# Altium schematic sheet NVME.SchDoc: DARKYDEN_NVME
size Letter; ApprovedBy: APPROUVÉ PAR; Author: Harold Malbrouck; Organization: Cegep Limoilou; Address1: 1300, 8e Avenue; Address2: Québec, QC; Address3: Canada; Address4: G1J 5L5; Revision: Rev.A; SheetNumber: 5; SheetTotal: 22
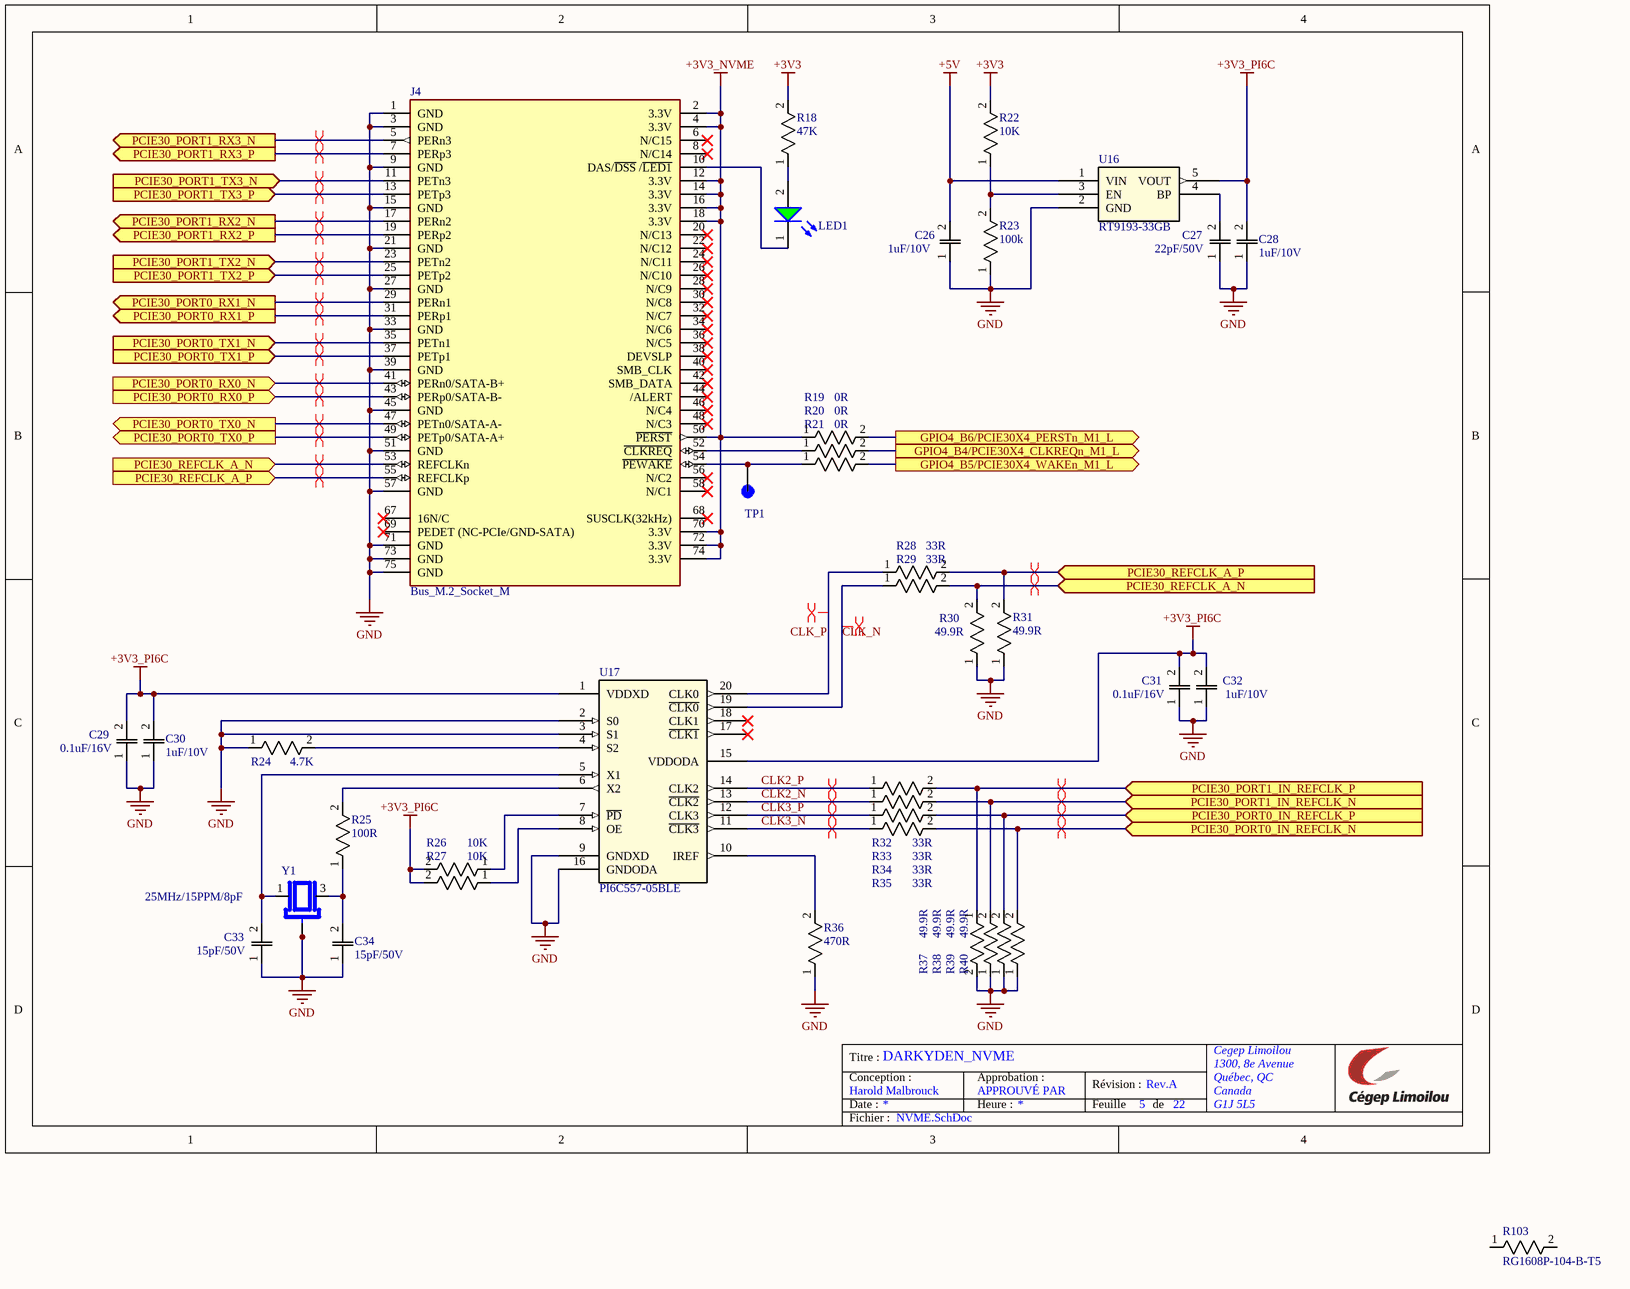
[diagram p0: NVME.SchDoc]

## Parts
C26  1uF/10V  [CAPC220145_100N_KEM]
C27  22pF/50V  [CAPC220145_145N_KEM]
C28  1uF/10V  [CAPC220145_100N_KEM]
C29  0.1uF/16V  [CAPC220145_88N_KEM]
C30  1uF/10V  [CAPC220145_100N_KEM]
C31  0.1uF/16V  [CAPC220145_88N_KEM]
C32  1uF/10V  [CAPC220145_100N_KEM]
C33  15pF/50V  [CAPC220145_88N_KEM]
C34  15pF/50V  [CAPC220145_88N_KEM]
J4  Bus_M.2_Socket_M  [AMPHENOL_MDT420M03001]
LED1  Green, 3.2V, 140°  [WL-SMCD_0603]  (value not drawn)
R18  47K  [RC0603N_PAN]
R19  0R  [ERJ3EKF1000V]
R20  0R  [ERJ3EKF1000V]
R21  0R  [ERJ3EKF1000V]
R22  10K  [ERJ3EKF1000V]
R23  100k  [ERJ3EKF1000V]
R24  4.7K  [RC0603N_PAN]
R25  100R  [RESC1608X55N]
R26  10K  [ERJ3EKF1000V]
R27  10K  [ERJ3EKF1000V]
R28  33R  [RC0603N_PAN]
R29  33R  [RC0603N_PAN]
R30  49.9R  [RC0603N_PAN]
R31  49.9R  [RC0603N_PAN]
R32  33R  [RC0603N_PAN]
R33  33R  [RC0603N_PAN]
R34  33R  [RC0603N_PAN]
R35  33R  [RC0603N_PAN]
R36  470R  [RC0603N_PAN]
R37  49.9R  [RC0603N_PAN]
R38  49.9R  [RC0603N_PAN]
R39  49.9R  [RC0603N_PAN]
R40  49.9R  [RC0603N_PAN]
R103  RG1608P-104-B-T5  [RES_0816_SUS]
TP1  5006  [KEYSTONE_5006]  (value not drawn)
U16  RT9193-33GB  [SOT-23-5_RIT]
U17  PI6C557-05BLE  [L20_PER-M]
Y1  25MHz/15PPM/8pF  [XTAL_ECS-250-8-37B2-RWY-TR]

## Ports
GPIO4_B4/PCIE30X4_CLKREQn_M1_L (out, see CONNECTEUR_3[1C]), GPIO4_B5/PCIE30X4_WAKEn_M1_L (out, see CONNECTEUR_3[2C]), GPIO4_B6/PCIE30X4_PERSTn_M1_L (out, see CONNECTEUR_3[2C]), PCIE30_PORT0_IN_REFCLK_N (in, see CONNECTEUR_3[3A]), PCIE30_PORT0_IN_REFCLK_P (in, see CONNECTEUR_3[3A]), PCIE30_PORT0_RX0_N (in, see CONNECTEUR_3[3A]), PCIE30_PORT0_RX0_P (in, see CONNECTEUR_3[3A]), PCIE30_PORT0_RX1_N (out, see CONNECTEUR_3[3A]), PCIE30_PORT0_RX1_P (out, see CONNECTEUR_3[3A]), PCIE30_PORT0_TX0_N (out, see CONNECTEUR_3[3B]), PCIE30_PORT0_TX0_P (out, see CONNECTEUR_3[3A]), PCIE30_PORT0_TX1_N (in, see CONNECTEUR_3[3B]), PCIE30_PORT0_TX1_P (in, see CONNECTEUR_3[3B]), PCIE30_PORT1_IN_REFCLK_N (in, see CONNECTEUR_3[3B]), PCIE30_PORT1_IN_REFCLK_P (in, see CONNECTEUR_3[3B]), PCIE30_PORT1_RX2_N (out, see CONNECTEUR_3[3B]), PCIE30_PORT1_RX2_P (out, see CONNECTEUR_3[3B]), PCIE30_PORT1_RX3_N (out, see CONNECTEUR_3[3B]), PCIE30_PORT1_RX3_P (out, see CONNECTEUR_3[3B]), PCIE30_PORT1_TX2_N (in, see CONNECTEUR_3[3B]), PCIE30_PORT1_TX2_P (in, see CONNECTEUR_3[3B]), PCIE30_PORT1_TX3_N (in, see CONNECTEUR_3[3B]), PCIE30_PORT1_TX3_P (in, see CONNECTEUR_3[3B]), PCIE30_REFCLK_A_N (in, see NVME[1B]), PCIE30_REFCLK_A_N (in, see NVME[3C]), PCIE30_REFCLK_A_P (in, see NVME[1B]), PCIE30_REFCLK_A_P (in, see NVME[3B])

## Nets
+3V3: R18.2 R22.2
+3V3_NVME: J4.2(3.3V) J4.4(3.3V) J4.12(3.3V) J4.14(3.3V) J4.16(3.3V) J4.18(3.3V) J4.50(~{PERST}) J4.70(3.3V) J4.72(3.3V) J4.74(3.3V) R19.1
+3V3_PI6C: C28.2 C29.2 C30.2 C31.2 C32.2 R26.2 R27.2 U16.5(VOUT) U17.1(VDDXD) U17.15(VDDODA)
+5V: C26.2 U16.1(VIN)
GND: C26.1 C27.1 C28.1 C29.1 C30.1 C31.1 C32.1 C33.1 C34.1 J4.1(GND) J4.3(GND) J4.9(GND) J4.15(GND) J4.21(GND) J4.27(GND) J4.33(GND) J4.39(GND) J4.45(GND) J4.51(GND) J4.57(GND) J4.71(GND) J4.73(GND) J4.75(GND) R23.1 R24.1 R30.1 R31.1 R36.1 R37.2 R38.1 R39.1 R40.1 U16.2(GND) U17.2(S0) U17.3(S1) U17.9(GNDXD) U17.16(GNDODA) Y1.2(GND) Y1.4(GND)
CLK2_N: R33.1 U17.13(~{CLK2})
CLK2_P: R32.1 U17.14(CLK2)
CLK3_N: R35.1 U17.11(~{CLK3})
CLK3_P: R34.1 U17.12(CLK3)
CLK_N: R29.1 U17.19(~{CLK0})
CLK_P: R28.1 U17.20(CLK0)
GPIO4_B4/PCIE30X4_CLKREQn_M1_L: R20.2 ; port GPIO4_B4/PCIE30X4_CLKREQn_M1_L
GPIO4_B5/PCIE30X4_WAKEn_M1_L: R21.2 ; port GPIO4_B5/PCIE30X4_WAKEn_M1_L
GPIO4_B6/PCIE30X4_PERSTn_M1_L: R19.2 ; port GPIO4_B6/PCIE30X4_PERSTn_M1_L
PCIE30_PORT0_IN_REFCLK_N: R35.2 R40.2 ; port PCIE30_PORT0_IN_REFCLK_N
PCIE30_PORT0_IN_REFCLK_P: R34.2 R39.2 ; port PCIE30_PORT0_IN_REFCLK_P
PCIE30_PORT0_RX0_N: J4.41(PERn0/SATA-B+) ; port PCIE30_PORT0_RX0_N
PCIE30_PORT0_RX0_P: J4.43(PERp0/SATA-B-) ; port PCIE30_PORT0_RX0_P
PCIE30_PORT0_RX1_N: J4.29(PERn1) ; port PCIE30_PORT0_RX1_N
PCIE30_PORT0_RX1_P: J4.31(PERp1) ; port PCIE30_PORT0_RX1_P
PCIE30_PORT0_TX0_N: J4.47(PETn0/SATA-A-) ; port PCIE30_PORT0_TX0_N
PCIE30_PORT0_TX0_P: J4.49(PETp0/SATA-A+) ; port PCIE30_PORT0_TX0_P
PCIE30_PORT0_TX1_N: J4.35(PETn1) ; port PCIE30_PORT0_TX1_N
PCIE30_PORT0_TX1_P: J4.37(PETp1) ; port PCIE30_PORT0_TX1_P
PCIE30_PORT1_IN_REFCLK_N: R33.2 R38.2 ; port PCIE30_PORT1_IN_REFCLK_N
PCIE30_PORT1_IN_REFCLK_P: R32.2 R37.1 ; port PCIE30_PORT1_IN_REFCLK_P
PCIE30_PORT1_RX2_N: J4.17(PERn2) ; port PCIE30_PORT1_RX2_N
PCIE30_PORT1_RX2_P: J4.19(PERp2) ; port PCIE30_PORT1_RX2_P
PCIE30_PORT1_RX3_N: J4.5(PERn3) ; port PCIE30_PORT1_RX3_N
PCIE30_PORT1_RX3_P: J4.7(PERp3) ; port PCIE30_PORT1_RX3_P
PCIE30_PORT1_TX2_N: J4.23(PETn2) ; port PCIE30_PORT1_TX2_N
PCIE30_PORT1_TX2_P: J4.25(PETp2) ; port PCIE30_PORT1_TX2_P
PCIE30_PORT1_TX3_N: J4.11(PETn3) ; port PCIE30_PORT1_TX3_N
PCIE30_PORT1_TX3_P: J4.13(PETp3) ; port PCIE30_PORT1_TX3_P
PCIE30_REFCLK_A_N: J4.53(REFCLKn) R29.2 R30.2 ; port PCIE30_REFCLK_A_N
PCIE30_REFCLK_A_P: J4.55(REFCLKp) R28.2 R31.2 ; port PCIE30_REFCLK_A_P
NetC27_2: C27.2 U16.4(BP)
NetC33_2: C33.2 U17.5(X1) Y1.1(IN/OUT)
NetC34_2: C34.2 R25.1 Y1.3(OUT/IN)
NetJ4_10: J4.10(DAS/~{DSS}_/~{LED1}) LED1.1(K)
NetJ4_52: J4.52(~{CLKREQ}) R20.1
NetJ4_54: J4.54(~{PEWAKE}) R21.1 TP1.TP
NetLED1_2: LED1.2(A) R18.1
NetR22_1: R22.1 R23.2 U16.3(EN)
NetR24_2: R24.2 U17.4(S2)
NetR25_2: R25.2 U17.6(X2)
NetR26_1: R26.1 U17.7(~{PD})
NetR27_1: R27.1 U17.8(OE)
NetR36_2: R36.2 U17.10(IREF)

Not connected (* = marked no-connect by the designer): J4 6(N/C15)* 8(N/C14)* 20(N/C13)* 22(N/C12)* 24(N/C11)* 26(N/C10)* 28(N/C9)* 30(N/C8)* 32(N/C7)* 34(N/C6)* 36(N/C5)* 38(DEVSLP)* 40(SMB_CLK)* 42(SMB_DATA)* 44(/ALERT)* 46(N/C4)* 48(N/C3)* 56(N/C2)* 58(N/C1)* 67(16N/C)* 68(SUSCLK(32kHz))* 69(PEDET_(NC-PCIe/GND-SATA))*; R103 1 2; U17 17(~{CLK1})* 18(CLK1)*

## Layout directives
differential pair: CLK2_N, CLK2_P, CLK3_N, CLK3_P, CLK_N, CLK_P, PCIE30_PORT0_IN_REFCLK_N, PCIE30_PORT0_IN_REFCLK_P, PCIE30_PORT0_RX0_N, PCIE30_PORT0_RX0_P, PCIE30_PORT0_RX1_N, PCIE30_PORT0_RX1_P, PCIE30_PORT0_TX0_N, PCIE30_PORT0_TX0_P, PCIE30_PORT0_TX1_N, PCIE30_PORT0_TX1_P, PCIE30_PORT1_IN_REFCLK_N, PCIE30_PORT1_IN_REFCLK_P, PCIE30_PORT1_RX2_N, PCIE30_PORT1_RX2_P, PCIE30_PORT1_RX3_N, PCIE30_PORT1_RX3_P, PCIE30_PORT1_TX2_N, PCIE30_PORT1_TX2_P, PCIE30_PORT1_TX3_N, PCIE30_PORT1_TX3_P, PCIE30_REFCLK_A_N, PCIE30_REFCLK_A_P

## Notes on the sheet
- Titre :
- Conception :
- Date :
- Approbation :
- Heure :
- Révision :
- Feuille
- de
- Fichier :

## Library data of the parts
C26 C28 C30 C32 = C0805C105K8RACTU: Multilayer Ceramic Capacitors MLCC - SMD/SMT 10V 1uF X7R 0805 10%; Mfr_Name: Kemet; Material: 4241ConductorMaterial; Dissipation Factor: 5%; Supplier: Digikey; Supplier Part Number: 399-C0805C105K8RACTUCT-ND; Manufacturer: KEMET; Manufacturer Part Number: C0805C105K8RACTU; RoHS: Yes; Category: Ceramic Capacitors; Stock: 113387; Pricing: 1=0.2, 10=0.112, 100=0.0701, 1000=0.04837 (USD); Mounting Technology: Surface Mount; Case/Package: 0805; Pins: 2NUMBER; Case Code (Imperial): 0805; Case Code (Metric): 2012; Dielectric Material: Ceramic; Min Operating Temperature: -55°C; Max Operating Temperature: 125°C; Packaging: Tape and Reel; Tolerance: 10%; Value: 1uF; Dielectric: X7R; Package Quantity: 1; Voltage Rating: 10V; Voltage Rating (DC): 10V; Termination: SMD/SMT; Voltage: 10V; Series: C; Construction: Flat; Length: 2mm; Width: 0.049inch; Height: 0.9mm; Depth: 1.25mm; Thickness: 0.039inch; Lead Pitch: 0.75mm; Radiation Hardening: No; Reach SVHC Compliant: No; RoHS Compliant: Yes; Lead Free: 5697LeadFree; ComponentLink1URL: https://datasheet.ciiva.com/6074/kem-c1002-x7r-smd-6074662.pdf?src-supplier=Farnell; ComponentLink1Description: https://datasheet.ciiva.com/6074/kem-c1002-x7r-smd-6074662.pdf?src-supplier=Farnell; ComponentLink2URL: https://datasheet.ciiva.com/22749/1918693-22749723.pdf?src-supplier=Element14; ComponentLink2Description: https://datasheet.ciiva.com/22749/1918693-22749723.pdf?src-supplier=Element14; ComponentLink3URL: https://datasheet.ciiva.com/46385/1851736-46385656.pdf?src-supplier=Element14; ComponentLink3Description: https://datasheet.ciiva.com/46385/1851736-46385656.pdf?src-supplier=Element14; ComponentLink4URL: https://datasheet.ciiva.com/46443/1851736-46443534.pdf?src-supplier=Element14; ComponentLink4Description: https://datasheet.ciiva.com/46443/1851736-46443534.pdf?src-supplier=Element14
C27 = C0805C220J5RACTU: Cap Ceramic 22pF 50V X7R 5% Pad SMD 0805 125°C T/R; Mfr_Name: Kemet; Temperature Coefficient: 30ppm/°C; Supplier: Digikey; Supplier Part Number: 399-17625-1-ND; Manufacturer: KEMET; Manufacturer Part Number: C0805C220J5RACTU; RoHS: Yes; Category: Ceramic Capacitors; Stock: 8069; Pricing: 1=0.13, 10=0.072, 100=0.0434, 1000=0.02906 (USD); Case/Package: 0805; Material: Ceramic; Dielectric Material: Ceramic; Min Operating Temperature: -55°C; Max Operating Temperature: 125°C; Value: 22pF; Dielectric: X7R; Voltage Rating: 50V; Voltage Rating (DC): 50V; Height: 880um; RoHS Compliant: Yes; ComponentLink1URL: https://datasheet.octopart.com/C0805C220J5RACTU-KEMET-datasheet-130256537.pdf?src-supplier=Farnell; ComponentLink1Description: https://datasheet.octopart.com/C0805C220J5RACTU-KEMET-datasheet-130256537.pdf?src-supplier=Farnell; ComponentLink2URL: https://datasheet.octopart.com/C0805C220J5RACTU-KEMET-datasheet-170333836.pdf?src-supplier=Newark; ComponentLink2Description: https://datasheet.octopart.com/C0805C220J5RACTU-KEMET-datasheet-170333836.pdf?src-supplier=Newark
C29 C31 = C0805C104K4RACAUTO: 0805 (2012METRIC) Ceramic Capacitor SMD Auto X7R 16V 0.1MUF ±10% X7R; Mfr_Name: Kemet; Material: 4241ConductorMaterial; Value: 100nF; Temperature Coefficient: 30ppm/°C; Supplier: Digikey; Supplier Part Number: 399-C0805C104K4RACAUTOCT-ND; Manufacturer: KEMET; Manufacturer Part Number: C0805C104K4RACAUTO; RoHS: Yes; Category: Ceramic Capacitors; Stock: 27573; Pricing: 1=0.19, 10=0.108, 100=0.0672, 1000=0.04624 (USD); Case/Package: 0805; Dielectric Material: 4241ConductorMaterial; Min Operating Temperature: -55°C; Max Operating Temperature: 125°C; Tolerance: 10%; Packaging: Tape and Reel; Dielectric: X7R; Voltage Rating: 16V; Voltage Rating (DC): 16V; Length: 2mm; Depth: 1.25mm; RoHS Compliant: Yes
C33 C34 = C0805C150K5RACAUTO: Multilayer Ceramic Capacitors MLCC - SMD/SMT 50V 15pF X7R 0805 10% AEC-Q200; Mfr_Name: Kemet; Supplier: Digikey; Supplier Part Number: 399-C0805C150K5RACAUTOCT-ND; Manufacturer: KEMET; Manufacturer Part Number: C0805C150K5RACAUTO; RoHS: Yes; Category: Ceramic Capacitors; Stock: 14268; Pricing: 1=0.22, 10=0.124, 100=0.0903 (USD); RoHS Compliant: Yes; ComponentLink1URL: https://datasheet.octopart.com/C0805C150K5RACAUTO-KEMET-datasheet-149524000.pdf?src-supplier=Farnell; ComponentLink1Description: https://datasheet.octopart.com/C0805C150K5RACAUTO-KEMET-datasheet-149524000.pdf?src-supplier=Farnell; ComponentLink2URL: https://datasheet.octopart.com/C0805C150K5RACAUTO-KEMET-datasheet-170212647.pdf?src-supplier=Newark; ComponentLink2Description: https://datasheet.octopart.com/C0805C150K5RACAUTO-KEMET-datasheet-170212647.pdf?src-supplier=Newark
J4 = Bus_M.2_Socket_M: MF: Amphenol Commercial; MP: MDT420M03001; Package: None; Price: None; Value: *; Availability: Unavailable
LED1 = GREEN: WL-SMCD Mono-color Chip LED Diffused, SMT, size 0603, Green, 3.2V, 140°; Manufacturer Part Number: 150060GS55040; Manufacturer: Wurth Elektronik; Case/Size Code: 0603; Chip Technology: InGaN; Dominant Wavelength: 525nm; Luminous Intensity: 430mcd; Peak Wavelength: 520nm; Category: Signal LEDs; Match Code: WL-SMCD; ComponentLink1Description: Website Link; ComponentLink1URL: https://www.we-online.com/redexpert/article/150060GS55040?ad; ComponentLink2Description: Datasheet Link; ComponentLink2URL: https://www.we-online.com/redexpert/spec/150060GS55040?ad; Mount: Surface Mount; Operating Temperature Max: 85°C; Operating Temperature Min: -40°C; Packaging: Tape and Reel; Length: 1.6mm; Width: 0.8mm; Height: 0.4mm; Emitting Color: Green; Forward Voltage: 3.2V; Viewing Angle: 140°
R18 = ERJ-3GEYJ473V: Resistor Thick Film 0603 47K Ohm 5% 1/10W 200ppm/C Molded SMD Punched Carrier T/R; Mfr_Name: Panasonic; Voltage Rating: 75V; Voltage Rating (DC): 50V; Value: 47kR; Power Rating: 100mW; Temperature Coefficient: 200ppm/°C; Supplier: Digikey; Supplier Part Number: P47KGCT-ND; Manufacturer: Panasonic; Manufacturer Part Number: ERJ-3GEYJ473V; RoHS: Yes; Category: Chip SMD Resistors; Stock: 564429; Pricing: 1=0.1, 10=0.033, 50=0.02, 100=0.0165, 500=0.01096, 1000=0.00939 (USD); Mounting Technology: Surface Mount; Case/Package: 0603; Contact Plating: Tin; Case Code (Metric): 1608; Case Code (Imperial): 0603; Min Operating Temperature: -55°C; Max Operating Temperature: 155°C; Package Quantity: 1; Termination: SMD/SMT; Series: ERJ; Tolerance: 5%; Packaging: Tape and Reel; Resistor Type: Thick Film; Number of Terminations: 2; Max Power Dissipation: 100mW; Features: Automotive AEC-Q200; Construction: Rectangular; Resistance Tolerance: 5%; Technology: THICK FILM; Length: 1.6mm; Width: 0.8mm; Height: 0.45mm; Depth: 0.8mm; Radiation Hardening: No; Reach SVHC Compliant: No; Lead Free: Lead Free; Military Standard: Not; RoHS Compliant: Yes; ComponentLink1URL: https://datasheet.ciiva.com/11821/0900766b80f806dd-11821464.pdf?src-supplier=Rs; ComponentLink1Description: https://datasheet.ciiva.com/11821/0900766b80f806dd-11821464.pdf?src-supplier=Rs; ComponentLink2URL: https://datasheet.ciiva.com/48531/aoa0000ce1-48531644.pdf?src-supplier=Avnet; ComponentLink2Description: https://datasheet.ciiva.com/48531/aoa0000ce1-48531644.pdf?src-supplier=Avnet; ComponentLink3URL: https://datasheet.ciiva.com/24024/aoa0000ce1-37422-24024310.pdf?src-supplier=Mouser; ComponentLink3Description: https://datasheet.ciiva.com/24024/aoa0000ce1-37422-24024310.pdf?src-supplier=Mouser; ComponentLink4URL: https://datasheet.ciiva.com/28587/1678796-28587208.pdf?src-supplier=Element14; ComponentLink4Description: https://datasheet.ciiva.com/28587/1678796-28587208.pdf?src-supplier=Element14; ComponentLink5URL: https://datasheet.ciiva.com/28681/1678796-28681548.pdf?src-supplier=Element14; ComponentLink5Description: https://datasheet.ciiva.com/28681/1678796-28681548.pdf?src-supplier=Element14; ComponentLink6URL: https://datasheet.ciiva.com/46377/1500035-46377557.pdf?src-supplier=Element14; ComponentLink6Description: https://datasheet.ciiva.com/46377/1500035-46377557.pdf?src-supplier=Element14; ComponentLink7URL: https://datasheet.ciiva.com/46389/1500035-46389464.pdf?src-supplier=Element14; ComponentLink7Description: https://datasheet.ciiva.com/46389/1500035-46389464.pdf?src-supplier=Element14
R19-R21 = ERJ-3GEY0R00V: Zero Ohm Resistor, Jumper, 0603 [1608 Metric], Thick Film, 100 mW, 1 A, Surface Mount; Manufacturer_Name: Panasonic; Power Rating: 100mW; Voltage Rating: 75V; Tolerance: 0%; Temperature Coefficient: 200ppm/°C; Datasheet Link: http://docs-europe.electrocomponents.com/webdocs/13ba/0900766b813ba21b.pdf; Height: 0.55mm; Manufacturer_Part_Number: ERJ-3GEY0R00V; Mouser Part Number: 667-ERJ-3GEY0R00V; Mouser Price/Stock: https://www.mouser.co.uk/ProductDetail/Panasonic/ERJ-3GEY0R00V?qs=66DK8nO8gJALIOqOWgiVwg%3D%3D; Arrow Part Number: ERJ-3GEY0R00V; Arrow Price/Stock: https://www.arrow.com/en/products/erj3gey0r00v/panasonic?region=europe; Supplier: Digikey; Supplier Part Number: P0.0GCT-ND; Manufacturer: Panasonic; Manufacturer Part Number: ERJ-3GEY0R00V; RoHS: Yes; Category: Chip SMD Resistors; Stock: 766631; Pricing: 1=0.1, 10=0.02, 25=0.0164, 50=0.0144, 100=0.0126, 250=0.0106, 500=0.00936, 1000=0.0083 (USD); Mounting Technology: Surface Mount; Case/Package: 0603; Case Code (Metric): 1608; Case Code (Imperial): 0603; Contact Plating: Tin; Min Operating Temperature: -55°C; Max Operating Temperature: 155°C; Packaging: Tape and Reel; Package Quantity: 5000; Value: 0R; Resistor Type: Thick Film; Number of Terminations: 2; Termination: SMD/SMT; Max Power Dissipation: 100mW; Features: Automotive AEC-Q200; Series: ERJ; Construction: Rectangular; Technology: THICK FILM; Length: 1.6mm; Width: 0.8mm; Depth: 0.8mm; Ratings: AEC-Q200; Radiation Hardening: No; Reach SVHC Compliant: No; Military Standard: Not; RoHS Compliant: Yes; Lead Free: 5697LeadFree; ComponentLink1URL: https://datasheet.ciiva.com/11808/0900766b80f806dd-11808207.pdf?src-supplier=Rs; ComponentLink1Description: https://datasheet.ciiva.com/11808/0900766b80f806dd-11808207.pdf?src-supplier=Rs; ComponentLink2URL: https://datasheet.ciiva.com/27055/1935748-27055113.pdf?src-supplier=Jameco; ComponentLink2Description: https://datasheet.ciiva.com/27055/1935748-27055113.pdf?src-supplier=Jameco; ComponentLink3URL: https://datasheet.ciiva.com/5959/1678796-5959707.pdf?src-supplier=Farnell; ComponentLink3Description: https://datasheet.ciiva.com/5959/1678796-5959707.pdf?src-supplier=Farnell; ComponentLink4URL: https://datasheet.ciiva.com/43460/1678796-43460647.pdf?src-supplier=Farnell; ComponentLink4Description: https://datasheet.ciiva.com/43460/1678796-43460647.pdf?src-supplier=Farnell; ComponentLink5URL: https://datasheet.ciiva.com/48532/aoa0000ce1-48532165.pdf?src-supplier=Avnet; ComponentLink5Description: https://datasheet.ciiva.com/48532/aoa0000ce1-48532165.pdf?src-supplier=Avnet; ComponentLink6URL: https://datasheet.ciiva.com/28695/1678796-28695833.pdf?src-supplier=Element14; ComponentLink6Description: https://datasheet.ciiva.com/28695/1678796-28695833.pdf?src-supplier=Element14; ComponentLink7URL: https://datasheet.ciiva.com/16834/aoa0000ce1-16834828.pdf?src-supplier=Future+Electronics; ComponentLink7Description: https://datasheet.ciiva.com/16834/aoa0000ce1-16834828.pdf?src-supplier=Future+Electronics; ComponentLink8URL: https://datasheet.ciiva.com/16758/70255313-16758527.pdf?src-supplier=Allied+Electronics; ComponentLink8Description: https://datasheet.ciiva.com/16758/70255313-16758527.pdf?src-supplier=Allied+Electronics; ComponentLink9URL: https://datasheet.ciiva.com/30199/4aoa0000ce1-30199822.pdf?src-supplier=Onlinecomponents.com; ComponentLink9Description: https://datasheet.ciiva.com/30199/4aoa0000ce1-30199822.pdf?src-supplier=Onlinecomponents.com; ComponentLink10URL: https://datasheet.ciiva.com/46377/1678796-46377868.pdf?src-supplier=Element14; ComponentLink10Description: https://datasheet.ciiva.com/46377/1678796-46377868.pdf?src-supplier=Element14; ComponentLink11URL: https://datasheet.ciiva.com/9198/aoa0000ce1-9198975.pdf?src-supplier=Avnet; ComponentLink11Description: https://datasheet.ciiva.com/9198/aoa0000ce1-9198975.pdf?src-supplier=Avnet
R22 R26 R27 = ERJ-3GEYJ103V: 10K Ohm 5% Res Thick Film 0603  0.1W(1/10W) ±200ppm/C Pad SMD Automotive T/R; Manufacturer_Name: Panasonic; Value: 10kR; Temperature Coefficient: 200ppm/°C; Power Rating: 100mW; Voltage Rating: 75V; Datasheet Link: http://docs-europe.electrocomponents.com/webdocs/13ba/0900766b813ba21b.pdf; Height: 0.55mm; Manufacturer_Part_Number: ERJ-3GEYJ103V; Mouser Part Number: 667-ERJ-3GEYJ103V; Mouser Price/Stock: https://www.mouser.co.uk/ProductDetail/Panasonic/ERJ-3GEYJ103V?qs=66DK8nO8gJBWgc%252B0VNNxzg%3D%3D; Arrow Part Number: ERJ-3GEYJ103V; Arrow Price/Stock: https://www.arrow.com/en/products/erj-3geyj103v/panasonic?region=europe; Supplier: Digikey; Supplier Part Number: P10KGCT-ND; Manufacturer: Panasonic; Manufacturer Part Number: ERJ-3GEYJ103V; RoHS: Yes; Category: Chip SMD Resistors; Stock: 2191587; Pricing: 1=0.1, 10=0.033, 50=0.02, 100=0.0165, 500=0.01096, 1000=0.00939 (USD); Mounting Technology: Surface Mount; Case/Package: 0603; Case Code (Imperial): 0603; Case Code (Metric): 1608; Weight: 7.1E-05oz; Contact Plating: Tin; Min Operating Temperature: -55°C; Max Operating Temperature: 155°C; Tolerance: 5%; Packaging: Tape and Reel; Technology: THICK FILM; Package Quantity: 1; Resistor Type: Thick Film; Termination: SMD/SMT; Number of Terminations: 2; Max Power Dissipation: 100mW; Working Voltage: 75V; Features: Automotive AEC-Q200; Series: ERJ; Construction: Rectangular; Resistance Tolerance: 5%; Length: 1.6mm; Width: 0.8mm; Depth: 0.8mm; Reach SVHC Compliant: No; Military Standard: Not; Lead Free: Lead Free; RoHS Compliant: Yes; ComponentLink1URL: https://datasheet.ciiva.com/11809/0900766b80f806dd-11809566.pdf?src-supplier=Rs; ComponentLink1Description: https://datasheet.ciiva.com/11809/0900766b80f806dd-11809566.pdf?src-supplier=Rs; ComponentLink2URL: https://datasheet.ciiva.com/34303/2007265-34303757.pdf?src-supplier=Jameco; ComponentLink2Description: https://datasheet.ciiva.com/34303/2007265-34303757.pdf?src-supplier=Jameco; ComponentLink3URL: https://datasheet.ciiva.com/48531/aoa0000ce1-48531887.pdf?src-supplier=Avnet; ComponentLink3Description: https://datasheet.ciiva.com/48531/aoa0000ce1-48531887.pdf?src-supplier=Avnet; ComponentLink4URL: https://datasheet.ciiva.com/9117/aoa0000ce1-9117038.pdf?src-supplier=Avnet; ComponentLink4Description: https://datasheet.ciiva.com/9117/aoa0000ce1-9117038.pdf?src-supplier=Avnet; ComponentLink5URL: https://datasheet.ciiva.com/28514/1678796-28514213.pdf?src-supplier=Element14; ComponentLink5Description: https://datasheet.ciiva.com/28514/1678796-28514213.pdf?src-supplier=Element14; ComponentLink6URL: https://datasheet.ciiva.com/46371/1678796-46371909.pdf?src-supplier=Element14; ComponentLink6Description: https://datasheet.ciiva.com/46371/1678796-46371909.pdf?src-supplier=Element14; ComponentLink7URL: https://datasheet.ciiva.com/46385/1678796-46385240.pdf?src-supplier=Element14; ComponentLink7Description: https://datasheet.ciiva.com/46385/1678796-46385240.pdf?src-supplier=Element14; ComponentLink8URL: https://datasheet.ciiva.com/24133/aoa0000ce1-37422-24133064.pdf?src-supplier=Mouser; ComponentLink8Description: https://datasheet.ciiva.com/24133/aoa0000ce1-37422-24133064.pdf?src-supplier=Mouser; ComponentLink9URL: https://datasheet.ciiva.com/16740/aoa0000ce1-16740655.pdf?src-supplier=Future+Electronics; ComponentLink9Description: https://datasheet.ciiva.com/16740/aoa0000ce1-16740655.pdf?src-supplier=Future+Electronics; ComponentLink10URL: https://datasheet.ciiva.com/30147/4aoa0000ce1-30147029.pdf?src-supplier=Onlinecomponents.com; ComponentLink10Description: https://datasheet.ciiva.com/30147/4aoa0000ce1-30147029.pdf?src-supplier=Onlinecomponents.com
R23 = ERJ-3GEYJ104V: 100K Ohm 5%  Res Thick Film 0603 1/10W +/-200ppm/ßC Molded SMD Punched Carrier T/R; Manufacturer_Name: Panasonic; Value: 100kR; Power Rating: 100mW; Voltage Rating: 75V; Temperature Coefficient: 200ppm/°C; Voltage Rating (DC): 50V; Datasheet Link: http://docs-europe.electrocomponents.com/webdocs/13ba/0900766b813ba21b.pdf; Height: 0.55mm; Manufacturer_Part_Number: ERJ-3GEYJ104V; Mouser Part Number: 667-ERJ-3GEYJ104V; Mouser Price/Stock: https://www.mouser.co.uk/ProductDetail/Panasonic/ERJ-3GEYJ104V?qs=66DK8nO8gJC7IhSuep78kw%3D%3D; Arrow Part Number: ERJ-3GEYJ104V; Arrow Price/Stock: https://www.arrow.com/en/products/erj-3geyj104v/panasonic?region=nac; Supplier: Digikey; Supplier Part Number: P100KGCT-ND; Manufacturer: Panasonic; Manufacturer Part Number: ERJ-3GEYJ104V; RoHS: Yes; Category: Chip SMD Resistors; Stock: 248896; Pricing: 1=0.1, 10=0.033, 50=0.02, 100=0.0165, 500=0.01096, 1000=0.00939 (USD); Mounting Technology: Surface Mount; Case/Package: 0603; Case Code (Imperial): 0603; Case Code (Metric): 1608; Weight: 7.1E-05oz; Contact Plating: Tin; Min Operating Temperature: -55°C; Max Operating Temperature: 155°C; Tolerance: 5%; Packaging: Tape and Reel; Package Quantity: 1; Resistor Type: Thick Film; Termination: SMD/SMT; Number of Terminations: 2; Max Power Dissipation: 100mW; Features: Automotive AEC-Q200; Series: ERJ; Construction: Rectangular; Resistance Tolerance: 5%; Technology: THICK FILM; Length: 1.6mm; Width: 0.8mm; Depth: 0.8mm; Reach SVHC Compliant: No; Military Standard: Not; RoHS Compliant: Yes; ComponentLink1URL: https://datasheet.ciiva.com/11809/0900766b80f806dd-11809567.pdf?src-supplier=Rs; ComponentLink1Description: https://datasheet.ciiva.com/11809/0900766b80f806dd-11809567.pdf?src-supplier=Rs; ComponentLink2URL: https://datasheet.ciiva.com/22758/1678796-22758220.pdf?src-supplier=Farnell; ComponentLink2Description: https://datasheet.ciiva.com/22758/1678796-22758220.pdf?src-supplier=Farnell; ComponentLink3URL: https://datasheet.ciiva.com/43460/1678796-43460761.pdf?src-supplier=Farnell; ComponentLink3Description: https://datasheet.ciiva.com/43460/1678796-43460761.pdf?src-supplier=Farnell; ComponentLink4URL: https://datasheet.ciiva.com/24159/aoa0000ce1-37422-24159717.pdf?src-supplier=Mouser; ComponentLink4Description: https://datasheet.ciiva.com/24159/aoa0000ce1-37422-24159717.pdf?src-supplier=Mouser; ComponentLink5URL: https://datasheet.ciiva.com/46380/1678796-46380412.pdf?src-supplier=Element14; ComponentLink5Description: https://datasheet.ciiva.com/46380/1678796-46380412.pdf?src-supplier=Element14; ComponentLink6URL: https://datasheet.ciiva.com/46389/1678796-46389629.pdf?src-supplier=Element14; ComponentLink6Description: https://datasheet.ciiva.com/46389/1678796-46389629.pdf?src-supplier=Element14; ComponentLink7URL: https://datasheet.ciiva.com/27055/1988495-27055706.pdf?src-supplier=Jameco; ComponentLink7Description: https://datasheet.ciiva.com/27055/1988495-27055706.pdf?src-supplier=Jameco; ComponentLink8URL: https://datasheet.ciiva.com/16762/70255313-16762591.pdf?src-supplier=Allied+Electronics; ComponentLink8Description: https://datasheet.ciiva.com/16762/70255313-16762591.pdf?src-supplier=Allied+Electronics; ComponentLink9URL: https://datasheet.ciiva.com/16508/aoa0000ce1-16508383.pdf?src-supplier=Future+Electronics; ComponentLink9Description: https://datasheet.ciiva.com/16508/aoa0000ce1-16508383.pdf?src-supplier=Future+Electronics
R24 = ERA-3AEB472V: Res Thin Film 0603 4.7K Ohm 0.1% 0.1W ±25ppm/°C Molded SMD Punched Carrier T/R; Mfr_Name: Panasonic; Voltage Rating: 75V; Value: 4.7kR; Power Rating: 100mW; Supplier: Digikey; Supplier Part Number: P4.7KDBCT-ND; Manufacturer: Panasonic; Manufacturer Part Number: ERA-3AEB472V; RoHS: Yes; Category: Chip SMD Resistors; Stock: 284751; Pricing: 1=0.1, 10=0.065, 50=0.0574, 100=0.0541, 500=0.0475, 1000=0.045 (USD); Mounting Technology: Surface Mount; Case/Package: 0603; Pins: 2; Contact Plating: Tin; Case Code (Metric): 1608; Case Code (Imperial): 0603; Min Operating Temperature: -55°C; Max Operating Temperature: 155°C; Packaging: Tape and Reel; Package Quantity: 5000; Termination: SMD/SMT; Series: ERA-3A; Tolerance: 0.1%; Resistor Type: Thin Film; Number of Terminations: 2; Temperature Coefficient: 25ppm/°C; Max Power Dissipation: 100mW; Voltage Rating (DC): 75V; Working Voltage: 75V; Construction: Rectangular; Resistance Tolerance: 0.1%; Technology: THIN FILM; Features: Automotive AEC-Q200; Length: 1.6mm; Width: 0.8mm; Height: 0.45mm; Depth: 0.8mm; Ratings: AEC-Q200; Radiation Hardening: No; Reach SVHC Compliant: No; RoHS Compliant: Yes; Military Standard: Not; Lead Free: Lead Free; ComponentLink1URL: https://datasheet.ciiva.com/11808/0900766b80fe20f7-11808039.pdf?src-supplier=Rs; ComponentLink1Description: https://datasheet.ciiva.com/11808/0900766b80fe20f7-11808039.pdf?src-supplier=Rs; ComponentLink2URL: https://datasheet.ciiva.com/29183/451124-da-01-en-widerstand-0603-era-29183789.pdf?src-supplier=Conrad; ComponentLink2Description: https://datasheet.ciiva.com/29183/451124-da-01-en-widerstand-0603-era-29183789.pdf?src-supplier=Conrad; ComponentLink3URL: https://datasheet.ciiva.com/22781/485442-22781497.pdf?src-supplier=Farnell; ComponentLink3Description: https://datasheet.ciiva.com/22781/485442-22781497.pdf?src-supplier=Farnell; ComponentLink4URL: https://datasheet.ciiva.com/43455/485442-43455227.pdf?src-supplier=Farnell; ComponentLink4Description: https://datasheet.ciiva.com/43455/485442-43455227.pdf?src-supplier=Farnell; ComponentLink5URL: https://datasheet.ciiva.com/9116/aoa0000ce26-9116681.pdf?src-supplier=Avnet; ComponentLink5Description: https://datasheet.ciiva.com/9116/aoa0000ce26-9116681.pdf?src-supplier=Avnet; ComponentLink6URL: https://datasheet.ciiva.com/9117/aoa0000ce26-9117707.pdf?src-supplier=Avnet; ComponentLink6Description: https://datasheet.ciiva.com/9117/aoa0000ce26-9117707.pdf?src-supplier=Avnet; ComponentLink7URL: https://datasheet.ciiva.com/48425/era-eng-tds-48425470.pdf?src-supplier=Distrelec; ComponentLink7Description: https://datasheet.ciiva.com/48425/era-eng-tds-48425470.pdf?src-supplier=Distrelec; ComponentLink8URL: https://datasheet.ciiva.com/46422/485442-46422693.pdf?src-supplier=Element14; ComponentLink8Description: https://datasheet.ciiva.com/46422/485442-46422693.pdf?src-supplier=Element14; ComponentLink9URL: https://datasheet.ciiva.com/30078/54aoa0000ce26-30078815.pdf?src-supplier=Onlinecomponents.com; ComponentLink9Description: https://datasheet.ciiva.com/30078/54aoa0000ce26-30078815.pdf?src-supplier=Onlinecomponents.com; ComponentLink10URL: https://datasheet.ciiva.com/22743/485442-22743061.pdf?src-supplier=Element14; ComponentLink10Description: https://datasheet.ciiva.com/22743/485442-22743061.pdf?src-supplier=Element14
R25 = ERJ-3EKF1000V: 100 Ohm 1% 1/10W 0603 ±100ppm/°C Molded SMD Punched Carrier T/R; Manufacturer_Name: Panasonic; Power Rating: 100mW; Voltage Rating: 75V; Datasheet Link: http://industrial.panasonic.com/cdbs/www-data/pdf/RDA0000/AOA0000C86.pdf; Height: 0.55mm; Manufacturer_Part_Number: ERJ-3EKF1000V; Mouser Part Number: 667-ERJ-3EKF1000V; Mouser Price/Stock: https://www.mouser.co.uk/ProductDetail/Panasonic/ERJ-3EKF1000V?qs=H7k1u0Mp9JS7i8KGO5m47A%3D%3D; Arrow Part Number: ERJ-3EKF1000V; Arrow Price/Stock: https://www.arrow.com/en/products/erj-3ekf1000v/panasonic?utm_currency=USD&region=nac; Supplier: Digikey; Supplier Part Number: P100HCT-ND; Manufacturer: Panasonic; Manufacturer Part Number: ERJ-3EKF1000V; RoHS: Yes; Category: Chip SMD Resistors; Stock: 1036225; Pricing: 1=0.1, 10=0.035, 100=0.0177, 1000=0.01014, 2500=0.00888 (USD); Mounting Technology: Surface Mount; Case/Package: 0603; Contact Plating: Tin; Case Code (Imperial): 0603; Case Code (Metric): 1608; Weight: 7.1E-05oz; Min Operating Temperature: -55°C; Max Operating Temperature: 155°C; Packaging: Tape and Reel; Package Quantity: 5000; Termination: SMD/SMT; Series: ERJ; Value: 100R; Tolerance: 1%; Resistor Type: Thick Film; Number of Terminations: 2; Temperature Coefficient: 100ppm/°C; Max Power Dissipation: 100mW; Voltage Rating (DC): 75V; Features: Automotive AEC-Q200; Resistance Tolerance: 1%; Construction: Rectangular; Length: 1.6mm; Width: 0.8mm; Depth: 0.8mm; Radiation Hardening: No; Reach SVHC Compliant: No; Lead Free: Lead Free; RoHS Compliant: Yes; Military Standard: Not; ComponentLink1URL: https://datasheet.ciiva.com/34303/1987450-34303565.pdf?src-supplier=Jameco; ComponentLink1Description: https://datasheet.ciiva.com/34303/1987450-34303565.pdf?src-supplier=Jameco; ComponentLink2URL: https://datasheet.ciiva.com/9186/aoa0000ce2-9186725.pdf?src-supplier=Avnet; ComponentLink2Description: https://datasheet.ciiva.com/9186/aoa0000ce2-9186725.pdf?src-supplier=Avnet; ComponentLink3URL: https://datasheet.ciiva.com/48530/aoa0000ce2-48530986.pdf?src-supplier=Avnet; ComponentLink3Description: https://datasheet.ciiva.com/48530/aoa0000ce2-48530986.pdf?src-supplier=Avnet; ComponentLink4URL: https://datasheet.ciiva.com/7830/aoa0000ce2-7830728.pdf?src-supplier=Element14; ComponentLink4Description: https://datasheet.ciiva.com/7830/aoa0000ce2-7830728.pdf?src-supplier=Element14; ComponentLink5URL: https://datasheet.ciiva.com/22667/1678782-22667887.pdf?src-supplier=Element14; ComponentLink5Description: https://datasheet.ciiva.com/22667/1678782-22667887.pdf?src-supplier=Element14; ComponentLink6URL: https://datasheet.ciiva.com/46372/1678782-46372726.pdf?src-supplier=Element14; ComponentLink6Description: https://datasheet.ciiva.com/46372/1678782-46372726.pdf?src-supplier=Element14; ComponentLink7URL: https://datasheet.ciiva.com/46372/1678782-46372727.pdf?src-supplier=Element14; ComponentLink7Description: https://datasheet.ciiva.com/46372/1678782-46372727.pdf?src-supplier=Element14; ComponentLink8URL: https://datasheet.ciiva.com/24159/aoa0000ce2-24159753.pdf?src-supplier=Mouser; ComponentLink8Description: https://datasheet.ciiva.com/24159/aoa0000ce2-24159753.pdf?src-supplier=Mouser; ComponentLink9URL: https://datasheet.ciiva.com/16765/70260748-16765766.pdf?src-supplier=Allied+Electronics; ComponentLink9Description: https://datasheet.ciiva.com/16765/70260748-16765766.pdf?src-supplier=Allied+Electronics; ComponentLink10URL: https://datasheet.ciiva.com/16762/70260748-16762666.pdf?src-supplier=Allied+Electronics; ComponentLink10Description: https://datasheet.ciiva.com/16762/70260748-16762666.pdf?src-supplier=Allied+Electronics; ComponentLink11URL: https://datasheet.ciiva.com/30088/aoa0000ce2-30088649.pdf?src-supplier=Onlinecomponents.com; ComponentLink11Description: https://datasheet.ciiva.com/30088/aoa0000ce2-30088649.pdf?src-supplier=Onlinecomponents.com
R28 R29 R32-R35 = ERJ-3EKF33R0V: Res Thick Film 0603 33 Ohm 1% 0.1W ±100ppm/°C Molded SMD Punched Carrier T/R; Mfr_Name: Panasonic; Power Rating: 100mW; Voltage Rating: 75V; Supplier: Digikey; Supplier Part Number: P33.0HCT-ND; Manufacturer: Panasonic; Manufacturer Part Number: ERJ-3EKF33R0V; RoHS: Yes; Category: Chip SMD Resistors; Stock: 430721; Pricing: 1=0.1, 10=0.035, 100=0.0177, 1000=0.01014, 2500=0.00888 (USD); Mounting Technology: Surface Mount; Case/Package: 0603; Pins: 2; Case Code (Metric): 1608; Case Code (Imperial): 0603; Contact Plating: Tin; Min Operating Temperature: -55°C; Max Operating Temperature: 155°C; Value: 33R; Tolerance: 1%; Packaging: Tape and Reel; Package Quantity: 1; Resistor Type: Thick Film; Number of Terminations: 2; Temperature Coefficient: 100ppm/°C; Termination: SMD/SMT; Max Power Dissipation: 100mW; Voltage Rating (DC): 75V; Features: Automotive AEC-Q200; Series: ERJ; Construction: Rectangular; Resistance Tolerance: 1%; Length: 1.6mm; Width: 0.8mm; Height: 0.022inch; Depth: 0.8mm; Radiation Hardening: No; Reach SVHC Compliant: No; Military Standard: Not; Lead Free: Lead Free; RoHS Compliant: Yes; ComponentLink1URL: https://datasheet.ciiva.com/5917/aoa0000ce2-5917831.pdf?src-supplier=Farnell; ComponentLink1Description: https://datasheet.ciiva.com/5917/aoa0000ce2-5917831.pdf?src-supplier=Farnell; ComponentLink2URL: https://datasheet.ciiva.com/48531/aoa0000ce2-48531007.pdf?src-supplier=Avnet; ComponentLink2Description: https://datasheet.ciiva.com/48531/aoa0000ce2-48531007.pdf?src-supplier=Avnet; ComponentLink3URL: https://datasheet.ciiva.com/30250/aoa0000ce2-30250862.pdf?src-supplier=Onlinecomponents.com; ComponentLink3Description: https://datasheet.ciiva.com/30250/aoa0000ce2-30250862.pdf?src-supplier=Onlinecomponents.com; ComponentLink4URL: https://datasheet.ciiva.com/16778/70260748-16778478.pdf?src-supplier=Allied+Electronics; ComponentLink4Description: https://datasheet.ciiva.com/16778/70260748-16778478.pdf?src-supplier=Allied+Electronics; ComponentLink5URL: https://datasheet.ciiva.com/16781/70260748-16781237.pdf?src-supplier=Allied+Electronics; ComponentLink5Description: https://datasheet.ciiva.com/16781/70260748-16781237.pdf?src-supplier=Allied+Electronics; ComponentLink6URL: https://datasheet.ciiva.com/22673/1678782-22673288.pdf?src-supplier=Element14; ComponentLink6Description: https://datasheet.ciiva.com/22673/1678782-22673288.pdf?src-supplier=Element14; ComponentLink7URL: https://datasheet.ciiva.com/24026/aoa0000ce2-24026635.pdf?src-supplier=Mouser; ComponentLink7Description: https://datasheet.ciiva.com/24026/aoa0000ce2-24026635.pdf?src-supplier=Mouser; ComponentLink8URL: https://datasheet.ciiva.com/22687/1678782-22687390.pdf?src-supplier=Element14; ComponentLink8Description: https://datasheet.ciiva.com/22687/1678782-22687390.pdf?src-supplier=Element14; ComponentLink9URL: https://datasheet.ciiva.com/7836/aoa0000ce2-7836503.pdf?src-supplier=Element14; ComponentLink9Description: https://datasheet.ciiva.com/7836/aoa0000ce2-7836503.pdf?src-supplier=Element14; ComponentLink10URL: https://datasheet.ciiva.com/7836/426256-7836821.pdf?src-supplier=Element14; ComponentLink10Description: https://datasheet.ciiva.com/7836/426256-7836821.pdf?src-supplier=Element14
R30 R31 R37-R40 = ERJ-3EKF49R9V: 100Mw Thick Film Resistors 100Ppm/ 1% 49.9 0603 Chip Resistor Surface Mount Rohs; Mfr_Name: Panasonic; Voltage Rating: 75V; Temperature Coefficient: 100ppm/°C; Working Voltage: 6V; Supplier: Digikey; Supplier Part Number: P49.9HCT-ND; Manufacturer: Panasonic; Manufacturer Part Number: ERJ-3EKF49R9V; RoHS: Yes; Category: Chip SMD Resistors; Stock: 459806; Pricing: 1=0.1, 10=0.035, 100=0.0177, 1000=0.01014, 2500=0.00888 (USD); Mounting Technology: Surface Mount; Case/Package: 0603; Case Code (Imperial): 0603; Case Code (Metric): 1608; Contact Plating: Tin; Min Operating Temperature: -55°C; Max Operating Temperature: 155°C; Packaging: Tape and Reel; Package Quantity: 5000; Value: 49.9R; Power Rating: 100mW; Tolerance: 1%; Resistor Type: Thick Film; Number of Terminations: 2; Termination: SMD/SMT; Max Power Dissipation: 100mW; Features: Automotive AEC-Q200; Series: ERJ; Resistance Tolerance: 1%; Construction: Rectangular; Technology: THICK FILM; Length: 1.6mm; Width: 0.8mm; Height: 0.022inch; Depth: 0.8mm; Radiation Hardening: No; Reach SVHC Compliant: No; RoHS Compliant: Yes; Military Standard: Not; ComponentLink1URL: https://datasheet.ciiva.com/48531/aoa0000ce2-48531019.pdf?src-supplier=Avnet; ComponentLink1Description: https://datasheet.ciiva.com/48531/aoa0000ce2-48531019.pdf?src-supplier=Avnet; ComponentLink2URL: https://datasheet.ciiva.com/30095/aoa0000ce2-30095355.pdf?src-supplier=Onlinecomponents.com; ComponentLink2Description: https://datasheet.ciiva.com/30095/aoa0000ce2-30095355.pdf?src-supplier=Onlinecomponents.com; ComponentLink3URL: https://datasheet.ciiva.com/9117/aoa0000ce2-9117128.pdf?src-supplier=Avnet; ComponentLink3Description: https://datasheet.ciiva.com/9117/aoa0000ce2-9117128.pdf?src-supplier=Avnet; ComponentLink4URL: https://datasheet.ciiva.com/16766/70260748-16766262.pdf?src-supplier=Allied+Electronics; ComponentLink4Description: https://datasheet.ciiva.com/16766/70260748-16766262.pdf?src-supplier=Allied+Electronics; ComponentLink5URL: https://datasheet.ciiva.com/16772/70260748-16772570.pdf?src-supplier=Allied+Electronics; ComponentLink5Description: https://datasheet.ciiva.com/16772/70260748-16772570.pdf?src-supplier=Allied+Electronics; ComponentLink6URL: https://datasheet.ciiva.com/28694/1678782-28694219.pdf?src-supplier=Element14; ComponentLink6Description: https://datasheet.ciiva.com/28694/1678782-28694219.pdf?src-supplier=Element14; ComponentLink7URL: https://datasheet.ciiva.com/46388/1678782-46388908.pdf?src-supplier=Element14; ComponentLink7Description: https://datasheet.ciiva.com/46388/1678782-46388908.pdf?src-supplier=Element14
R36 = ERJ-3GEYJ471V: Res Thick Film 0603 470 Ohm 5% 1/10W +/-200ppm/ßC Molded SMD Punched Carrier T/R; Mfr_Name: Panasonic; Voltage Rating: 75V; Power Rating: 100mW; Temperature Coefficient: 200ppm/°C; Supplier: Digikey; Supplier Part Number: P470GCT-ND; Manufacturer: Panasonic; Manufacturer Part Number: ERJ-3GEYJ471V; RoHS: Yes; Category: Chip SMD Resistors; Mounting Technology: Surface Mount; Case/Package: 0603; Pins: 2NUMBER; Case Code (Metric): 1608; Case Code (Imperial): 0603; Weight: 7.1E-05oz; Contact Plating: Tin; Min Operating Temperature: -55°C; Max Operating Temperature: 155°C; Value: 470R; Tolerance: 5%; Packaging: Tape and Reel; Package Quantity: 1; Resistor Type: Thick Film; Number of Terminations: 2; Termination: SMD/SMT; Max Power Dissipation: 100mW; Voltage Rating (DC): 75V; Features: Automotive AEC-Q200; Series: ERJ; Resistance Tolerance: 5%; Construction: Rectangular; Technology: THICK FILM; Length: 1.6mm; Width: 0.8mm; Height: 0.45mm; Depth: 0.8mm; Radiation Hardening: No; Reach SVHC Compliant: No; Military Standard: Not; Lead Free: Lead Free; RoHS Compliant: Yes; ComponentLink1URL: https://datasheet.ciiva.com/11821/0900766b80f806dd-11821465.pdf?src-supplier=Rs; ComponentLink1Description: https://datasheet.ciiva.com/11821/0900766b80f806dd-11821465.pdf?src-supplier=Rs; ComponentLink2URL: https://datasheet.ciiva.com/6138/1678796-6138175.pdf?src-supplier=Farnell; ComponentLink2Description: https://datasheet.ciiva.com/6138/1678796-6138175.pdf?src-supplier=Farnell; ComponentLink3URL: https://datasheet.ciiva.com/9117/aoa0000ce1-9117207.pdf?src-supplier=Avnet; ComponentLink3Description: https://datasheet.ciiva.com/9117/aoa0000ce1-9117207.pdf?src-supplier=Avnet; ComponentLink4URL: https://datasheet.ciiva.com/28676/1678796-28676277.pdf?src-supplier=Element14; ComponentLink4Description: https://datasheet.ciiva.com/28676/1678796-28676277.pdf?src-supplier=Element14; ComponentLink5URL: https://datasheet.ciiva.com/46377/1678796-46377559.pdf?src-supplier=Element14; ComponentLink5Description: https://datasheet.ciiva.com/46377/1678796-46377559.pdf?src-supplier=Element14; ComponentLink6URL: https://datasheet.ciiva.com/46389/1678796-46389462.pdf?src-supplier=Element14; ComponentLink6Description: https://datasheet.ciiva.com/46389/1678796-46389462.pdf?src-supplier=Element14; ComponentLink7URL: https://datasheet.ciiva.com/16449/aoa0000ce1-16449526.pdf?src-supplier=Future+Electronics; ComponentLink7Description: https://datasheet.ciiva.com/16449/aoa0000ce1-16449526.pdf?src-supplier=Future+Electronics; ComponentLink8URL: https://datasheet.ciiva.com/16767/70255313-16767606.pdf?src-supplier=Allied+Electronics; ComponentLink8Description: https://datasheet.ciiva.com/16767/70255313-16767606.pdf?src-supplier=Allied+Electronics; ComponentLink9URL: https://datasheet.ciiva.com/16777/70255313-16777174.pdf?src-supplier=Allied+Electronics; ComponentLink9Description: https://datasheet.ciiva.com/16777/70255313-16777174.pdf?src-supplier=Allied+Electronics; ComponentLink10URL: https://datasheet.ciiva.com/30073/4aoa0000ce1-30073208.pdf?src-supplier=Onlinecomponents.com; ComponentLink10Description: https://datasheet.ciiva.com/30073/4aoa0000ce1-30073208.pdf?src-supplier=Onlinecomponents.com
R103 = RG1608P-104-B-T5: No Description Available; Mfr_Name: Susumu
TP1 = 5006: Test Point Compact THM PC .350 L .125 OD Heat Resistant Nylon 46 Black | Keystone Electronics 5006; MF: Keystone Electronics Corp.; SnapEDA_Link: https://www.snapeda.com/parts/5006/Keystone/view-part/?ref=snap; Package: NON STANDARD-1 Keystone; Value: *; MP: 5006; Check_prices: https://www.snapeda.com/parts/5006/Keystone/view-part/?ref=eda
U16 = RT9193-33GB: RT9193 Series 300 mA 3.3 V Ultra-Low Noise Ultra-Fast CMOS LDO Regulator-SC-70-5; Mfr_Name: Richtek Technology; Manufacturer: Richtek; Dropout Voltage: 220mV; Min Input Voltage: 2.5V; Max Supply Voltage: 5.5V; Nominal Output Voltage: 3.3V; Output Current: 300mA; Number of Regulators: 1; Output Type: Fixed; Output Configuration: Positive; Quiescent Current: 130uA; Power Supply Rejection Ratio (PSRR): 50dB; RefDes: RefDes; Type: Type; Supplier: Digikey; Supplier Part Number: 1028-1014-1-ND; Manufacturer Part Number: RT9193-33GB; RoHS: Yes; Category: Voltage Regulators - Linear; Stock: 19103; Pricing: 1=0.88, 10=0.533, 25=0.4408, 100=0.3365, 250=0.28532, 500=0.25378, 1000=0.22736 (USD); Mounting Technology: Surface Mount; Case/Package: SOT-23-5; Pins: 5; Min Operating Temperature: -40°C; Max Operating Temperature: 125°C; Packaging: Cut Tape; Series: -; Min Output Voltage: 3.3V; Lead Free: Lead Free; RoHS Compliant: Yes; Reach SVHC Compliant: Unknown; ComponentLink1URL: https://datasheet.ciiva.com/2046/3d3futf-83fb3frfm5mtkzlte2lnbkzg3d3d3f3d-2046896.pdf?src-supplier=Digikey; ComponentLink1Description: https://datasheet.ciiva.com/2046/3d3futf-83fb3frfm5mtkzlte2lnbkzg3d3d3f3d-2046896.pdf?src-supplier=Digikey; ComponentLink2URL: https://datasheet.ciiva.com/28652/1782157-28652989.pdf?src-supplier=Element14; ComponentLink2Description: https://datasheet.ciiva.com/28652/1782157-28652989.pdf?src-supplier=Element14
U17 = PI6C557-05BLE: Clock Generators & Support Products PCI express Gen 2 4 output clock gen; Mfr_Name: Pericom; Manufacturer: Diodes; Number of Circuits: 1; Clock Frequency: 200MHz; Input: Crystal; PLL: Yes; Operating Supply Voltage: 3.3V; Min Supply Voltage: 3.135V; Max Supply Voltage: 3.465V; Supply Current: 120mA; RefDes: RefDes; Type: Type; Supplier: Digikey; Supplier Part Number: PI6C557-05BLE-ND; Manufacturer Part Number: PI6C557-05BLE; RoHS: Yes; Category: Clock and Timing; Stock: 29; Pricing: 1=3.43, 10=2.188, 74=1.56716, 148=1.41622, 296=1.2898, 518=1.20288, 1036=1.1111, 2516=1.05 (USD); Mounting Technology: Surface Mount; Case/Package: TSSOP; Pins: 20; Min Operating Temperature: -40°C; Max Operating Temperature: 85°C; Package Quantity: 74; Packaging: Rail/Tube; Series: -; Number of Elements: 1; RoHS Compliant: Yes; ComponentLink1URL: https://datasheet.ciiva.com/14827/pi6c557-05b-14827350.pdf?src-supplier=Arrow+Electronics; ComponentLink1Description: https://datasheet.ciiva.com/14827/pi6c557-05b-14827350.pdf?src-supplier=Arrow+Electronics; ComponentLink2URL: https://datasheet.ciiva.com/12295/pi6c557-05b-218523-12295667.pdf?src-supplier=Mouser; ComponentLink2Description: https://datasheet.ciiva.com/12295/pi6c557-05b-218523-12295667.pdf?src-supplier=Mouser
Y1 = ECS-250-8-37B2-RWY-TR: Crystal 25MHz ±15ppm (Tol) ±15ppm (Stability) 8pF FUND 50Ohm 4-Pin Mini-CSMD T/R; Manufacturer: ECS International; MF: {'manufacturer': u'ECS Inc.'}; Package: None; Price: None; Value: *; MP: ECS-250-8-37B2-RWY-TR; Availability: Unavailable; Supplier: Digikey; Supplier Part Number: 50-ECS-250-8-37B2-RWY-TRCT-ND; Manufacturer Part Number: ECS-250-8-37B2-RWY-TR; RoHS: No; Category: Crystals; Stock: 26122; Pricing: 1=0.37, 10=0.321, 50=0.2914, 100=0.2794, 500=0.25326, 1000=0.24278 (USD); ComponentLink1URL: https://datasheet.octopart.com/ECS-250-8-37B2-RWY-TR-ECS-International-datasheet-163707945.pdf?src-supplier=Electro+Sonic; ComponentLink1Description: https://datasheet.octopart.com/ECS-250-8-37B2-RWY-TR-ECS-International-datasheet-163707945.pdf?src-supplier=Electro+Sonic